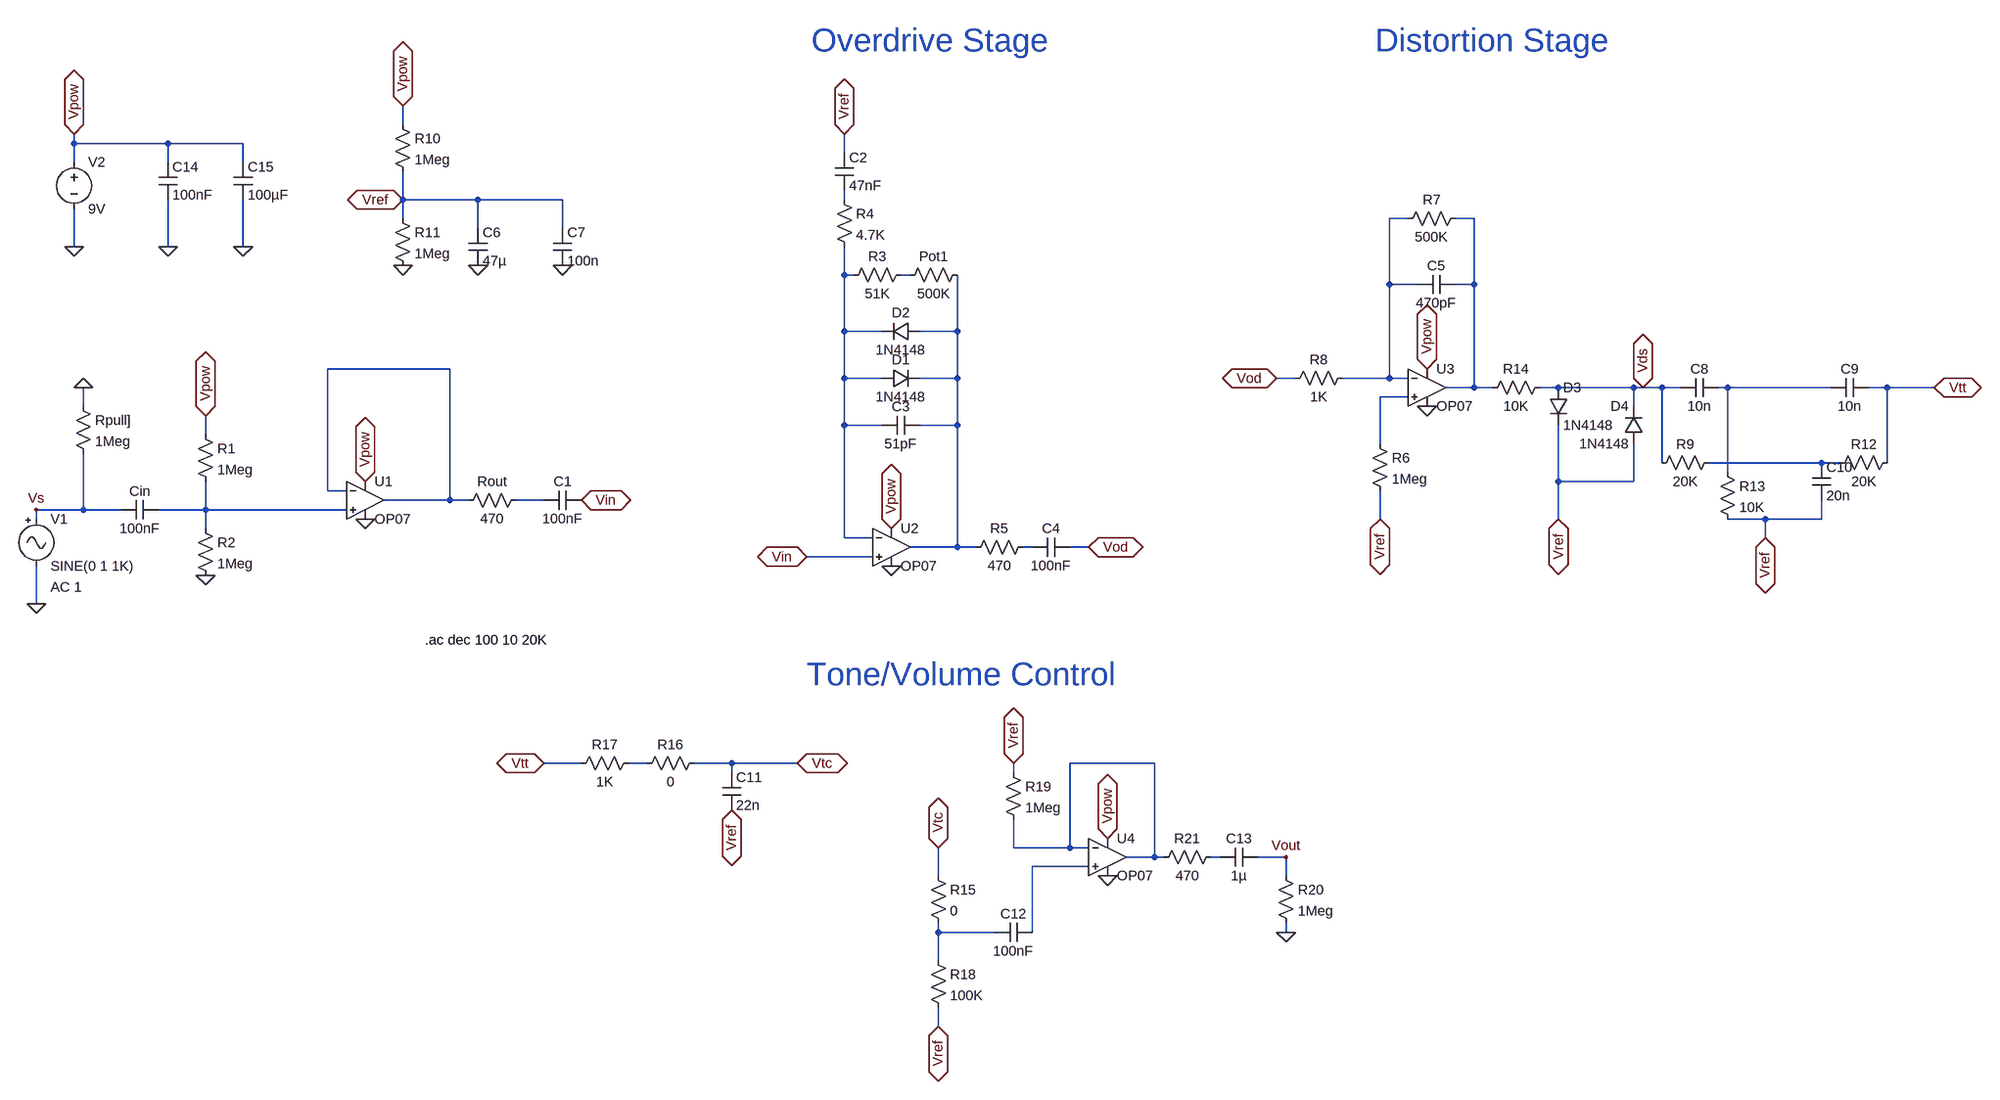
[diagram p0: schematic Overdrive_Distortion_Schematic.asc]
Overdrive_Distortion_Schematic.asc, the LTspice schematic file:
Version 4
SHEET 1 2212 1680
WIRE -912 16 -912 -16
WIRE -1472 48 -1472 32
WIRE -1312 48 -1472 48
WIRE -1184 48 -1312 48
WIRE -160 64 -160 32
WIRE -1472 80 -1472 48
WIRE -1312 80 -1312 48
WIRE -1184 80 -1184 48
WIRE -912 144 -912 96
WIRE -784 144 -912 144
WIRE -640 144 -784 144
WIRE -160 144 -160 128
WIRE -912 176 -912 144
WIRE 800 176 768 176
WIRE 912 176 880 176
WIRE -784 192 -784 144
WIRE -640 192 -640 144
WIRE -1472 224 -1472 160
WIRE -1312 224 -1312 144
WIRE -1184 224 -1184 144
WIRE -160 272 -160 224
WIRE -144 272 -160 272
WIRE -48 272 -64 272
WIRE 768 288 768 176
WIRE 816 288 768 288
WIRE 912 288 912 176
WIRE 912 288 880 288
WIRE -160 368 -160 272
WIRE -96 368 -160 368
WIRE 32 368 32 272
WIRE 32 368 -32 368
WIRE -832 432 -1040 432
WIRE -160 448 -160 368
WIRE -96 448 -160 448
WIRE 32 448 32 368
WIRE 32 448 -32 448
WIRE 608 448 576 448
WIRE 768 448 768 288
WIRE 768 448 688 448
WIRE 800 448 768 448
WIRE 912 464 912 288
WIRE 912 464 864 464
WIRE 944 464 912 464
WIRE 1056 464 1024 464
WIRE 1184 464 1056 464
WIRE 1200 464 1184 464
WIRE 1232 464 1200 464
WIRE 1264 464 1232 464
WIRE 1344 464 1328 464
WIRE 1520 464 1344 464
WIRE 1616 464 1584 464
WIRE 1696 464 1616 464
WIRE 800 480 752 480
WIRE -1456 496 -1456 464
WIRE 1184 496 1184 464
WIRE -160 528 -160 448
WIRE -96 528 -160 528
WIRE 32 528 32 448
WIRE 32 528 -32 528
WIRE -1248 544 -1248 512
WIRE 752 560 752 480
WIRE 1232 592 1232 464
WIRE 1504 592 1312 592
WIRE 1536 592 1504 592
WIRE 1616 592 1616 464
WIRE 1344 608 1344 464
WIRE 1056 624 1056 528
WIRE 1184 624 1184 560
WIRE 1184 624 1056 624
WIRE -1040 640 -1040 432
WIRE -1008 640 -1040 640
WIRE -832 656 -832 432
WIRE -832 656 -944 656
WIRE -800 656 -832 656
WIRE -672 656 -720 656
WIRE -1456 672 -1456 576
WIRE -1456 672 -1536 672
WIRE -1392 672 -1456 672
WIRE -1248 672 -1248 624
WIRE -1248 672 -1328 672
WIRE -1008 672 -1248 672
WIRE -1536 688 -1536 672
WIRE 752 688 752 640
WIRE 1056 688 1056 624
WIRE 1408 688 1344 688
WIRE 1504 688 1504 656
WIRE 1504 688 1408 688
WIRE -1248 704 -1248 672
WIRE -160 720 -160 528
WIRE -112 720 -160 720
WIRE 1408 720 1408 688
WIRE 32 736 32 528
WIRE 32 736 -48 736
WIRE 64 736 32 736
WIRE 160 736 144 736
WIRE 256 736 224 736
WIRE -112 752 -224 752
WIRE -1536 832 -1536 768
WIRE -608 1104 -672 1104
WIRE -496 1104 -528 1104
WIRE -352 1104 -416 1104
WIRE -240 1104 -352 1104
WIRE 368 1104 224 1104
WIRE -352 1120 -352 1104
WIRE 128 1120 128 1104
WIRE 128 1248 128 1200
WIRE 224 1248 224 1104
WIRE 224 1248 128 1248
WIRE 256 1248 224 1248
WIRE 368 1264 368 1104
WIRE 368 1264 320 1264
WIRE 384 1264 368 1264
WIRE 480 1264 464 1264
WIRE 592 1264 544 1264
WIRE 256 1280 160 1280
WIRE 0 1296 0 1248
WIRE 592 1296 592 1264
WIRE 0 1392 0 1376
WIRE 96 1392 0 1392
WIRE 160 1392 160 1280
WIRE 592 1392 592 1376
WIRE 0 1440 0 1392
WIRE 0 1552 0 1520
FLAG -1536 832 0
FLAG -1248 784 0
FLAG -1456 464 0
FLAG -1472 224 0
FLAG -1472 32 Vpow
IOPIN -1472 32 BiDir
FLAG -1248 512 Vpow
IOPIN -1248 512 BiDir
FLAG -976 624 Vpow
IOPIN -976 624 BiDir
FLAG -80 704 Vpow
IOPIN -80 704 BiDir
FLAG 832 432 Vpow
IOPIN 832 432 BiDir
FLAG -976 688 0
FLAG -80 768 0
FLAG 832 496 0
FLAG -912 256 0
FLAG -912 -16 Vpow
IOPIN -912 -16 BiDir
FLAG -160 32 Vref
IOPIN -160 32 BiDir
FLAG 752 688 Vref
IOPIN 752 688 BiDir
FLAG 1056 688 Vref
IOPIN 1056 688 BiDir
FLAG -1536 672 Vs
FLAG -784 256 0
FLAG -640 256 0
FLAG 1408 720 Vref
IOPIN 1408 720 BiDir
FLAG -608 656 Vin
IOPIN -608 656 BiDir
FLAG 256 736 Vod
IOPIN 256 736 BiDir
FLAG 576 448 Vod
IOPIN 576 448 BiDir
FLAG -912 144 Vref
IOPIN -912 144 BiDir
FLAG 1696 464 Vtt
IOPIN 1696 464 BiDir
FLAG -224 752 Vin
IOPIN -224 752 BiDir
FLAG 1200 464 Vds
IOPIN 1200 464 BiDir
FLAG -352 1184 Vref
IOPIN -352 1184 BiDir
FLAG -672 1104 Vtt
IOPIN -672 1104 BiDir
FLAG -240 1104 Vtc
IOPIN -240 1104 BiDir
FLAG 0 1552 Vref
IOPIN 0 1552 BiDir
FLAG 0 1248 Vtc
IOPIN 0 1248 BiDir
FLAG 128 1104 Vref
IOPIN 128 1104 BiDir
FLAG 592 1264 Vout
FLAG 288 1232 Vpow
IOPIN 288 1232 BiDir
FLAG 288 1296 0
FLAG 592 1392 0
FLAG -1312 224 0
FLAG -1184 224 0
SYMBOL OpAmps\\OP07 -976 592 R0
SYMATTR InstName U1
SYMBOL Misc\\signal -1536 672 R0
WINDOW 123 24 132 Left 2
WINDOW 39 0 0 Left 0
SYMATTR Value2 AC 1
SYMATTR InstName V1
SYMBOL cap -1328 656 R90
WINDOW 0 0 32 VBottom 2
WINDOW 3 32 32 VTop 2
SYMATTR InstName Cin
SYMATTR Value 100nF
SYMBOL res -1264 528 R0
SYMATTR InstName R1
SYMATTR Value 1Meg
SYMBOL res -1264 688 R0
SYMATTR InstName R2
SYMATTR Value 1Meg
SYMBOL res -704 640 R90
WINDOW 0 0 56 VBottom 2
WINDOW 3 32 56 VTop 2
SYMATTR InstName Rout
SYMATTR Value 470
SYMBOL cap -608 640 R90
WINDOW 0 0 32 VBottom 2
WINDOW 3 32 32 VTop 2
SYMATTR InstName C1
SYMATTR Value 100nF
SYMBOL OpAmps\\OP07 -80 672 R0
SYMATTR InstName U2
SYMBOL res 48 256 R90
WINDOW 0 0 56 VBottom 2
WINDOW 3 32 56 VTop 2
SYMATTR InstName Pot1
SYMATTR Value 500K
SYMBOL res -176 128 R0
SYMATTR InstName R4
SYMATTR Value 4.7K
SYMBOL diode -96 464 R270
WINDOW 0 32 32 VTop 2
WINDOW 3 0 32 VBottom 2
SYMATTR InstName D1
SYMATTR Value 1N4148
SYMBOL diode -32 352 R90
WINDOW 0 0 32 VBottom 2
WINDOW 3 32 32 VTop 2
SYMATTR InstName D2
SYMATTR Value 1N4148
SYMBOL cap -176 64 R0
SYMATTR InstName C2
SYMATTR Value 47nF
SYMBOL cap -32 512 R90
WINDOW 0 0 32 VBottom 2
WINDOW 3 32 32 VTop 2
SYMATTR InstName C3
SYMATTR Value 51pF
SYMBOL res -48 256 R90
WINDOW 0 0 56 VBottom 2
WINDOW 3 32 56 VTop 2
SYMATTR InstName R3
SYMATTR Value 51K
SYMBOL OpAmps\\OP07 832 400 R0
SYMATTR InstName U3
SYMBOL cap 224 720 R90
WINDOW 0 0 32 VBottom 2
WINDOW 3 32 32 VTop 2
SYMATTR InstName C4
SYMATTR Value 100nF
SYMBOL cap 880 272 R90
WINDOW 0 0 32 VBottom 2
WINDOW 3 32 32 VTop 2
SYMATTR InstName C5
SYMATTR Value 470pF
SYMBOL res 896 160 R90
WINDOW 0 0 56 VBottom 2
WINDOW 3 32 56 VTop 2
SYMATTR InstName R7
SYMATTR Value 500K
SYMBOL diode 1040 464 R0
SYMATTR InstName D3
SYMATTR Value 1N4148
SYMBOL diode 1200 560 R180
WINDOW 0 24 64 Left 2
WINDOW 3 24 0 Left 2
SYMATTR InstName D4
SYMATTR Value 1N4148
SYMBOL res 160 720 R90
WINDOW 0 0 56 VBottom 2
WINDOW 3 32 56 VTop 2
SYMATTR InstName R5
SYMATTR Value 470
SYMBOL res 736 544 R0
SYMATTR InstName R6
SYMATTR Value 1Meg
SYMBOL res -1472 480 R0
SYMATTR InstName Rpull]
SYMATTR Value 1Meg
SYMBOL res 704 432 R90
WINDOW 0 0 56 VBottom 2
WINDOW 3 32 56 VTop 2
SYMATTR InstName R8
SYMATTR Value 1K
SYMBOL voltage -1472 64 R0
WINDOW 123 0 0 Left 0
WINDOW 39 0 0 Left 0
SYMATTR InstName V2
SYMATTR Value 9V
SYMBOL res -928 0 R0
SYMATTR InstName R10
SYMATTR Value 1Meg
SYMBOL res -928 160 R0
SYMATTR InstName R11
SYMATTR Value 1Meg
SYMBOL cap -800 192 R0
SYMATTR InstName C6
SYMATTR Value 47µ
SYMBOL cap -656 192 R0
SYMATTR InstName C7
SYMATTR Value 100n
SYMBOL res 1632 576 R90
WINDOW 0 0 56 VBottom 2
WINDOW 3 32 56 VTop 2
SYMATTR InstName R12
SYMATTR Value 20K
SYMBOL cap 1328 448 R90
WINDOW 0 0 32 VBottom 2
WINDOW 3 32 32 VTop 2
SYMATTR InstName C8
SYMATTR Value 10n
SYMBOL cap 1584 448 R90
WINDOW 0 0 32 VBottom 2
WINDOW 3 32 32 VTop 2
SYMATTR InstName C9
SYMATTR Value 10n
SYMBOL res 1328 592 R0
SYMATTR InstName R13
SYMATTR Value 10K
SYMBOL cap 1488 592 R0
SYMATTR InstName C10
SYMATTR Value 20n
SYMBOL res 1040 448 R90
WINDOW 0 0 56 VBottom 2
WINDOW 3 32 56 VTop 2
SYMATTR InstName R14
SYMATTR Value 10K
SYMBOL res 1328 576 R90
WINDOW 0 0 56 VBottom 2
WINDOW 3 32 56 VTop 2
SYMATTR InstName R9
SYMATTR Value 20K
SYMBOL res -400 1088 R90
WINDOW 0 0 56 VBottom 2
WINDOW 3 32 56 VTop 2
SYMATTR InstName R16
SYMATTR Value 0
SYMBOL cap -368 1120 R0
SYMATTR InstName C11
SYMATTR Value 22n
SYMBOL res -16 1280 R0
SYMATTR InstName R15
SYMATTR Value 0
SYMBOL res -512 1088 R90
WINDOW 0 0 56 VBottom 2
WINDOW 3 32 56 VTop 2
SYMATTR InstName R17
SYMATTR Value 1K
SYMBOL OpAmps\\OP07 288 1200 R0
SYMATTR InstName U4
SYMBOL res -16 1424 R0
SYMATTR InstName R18
SYMATTR Value 100K
SYMBOL cap 160 1376 R90
WINDOW 0 0 32 VBottom 2
WINDOW 3 32 32 VTop 2
SYMATTR InstName C12
SYMATTR Value 100nF
SYMBOL res 112 1104 R0
SYMATTR InstName R19
SYMATTR Value 1Meg
SYMBOL cap 544 1248 R90
WINDOW 0 0 32 VBottom 2
WINDOW 3 32 32 VTop 2
SYMATTR InstName C13
SYMATTR Value 1µ
SYMBOL res 576 1280 R0
SYMATTR InstName R20
SYMATTR Value 1Meg
SYMBOL res 480 1248 R90
WINDOW 0 0 56 VBottom 2
WINDOW 3 32 56 VTop 2
SYMATTR InstName R21
SYMATTR Value 470
SYMBOL cap -1328 80 R0
SYMATTR InstName C14
SYMATTR Value 100nF
SYMBOL cap -1200 80 R0
SYMATTR InstName C15
SYMATTR Value 100µF
TEXT -216 -128 Left 5 ;Overdrive Stage
TEXT 744 -128 Left 5 ;Distortion Stage
TEXT -224 952 Left 5 ;Tone/Volume Control
TEXT -874 894 Left 2 !.ac dec 100 10 20K

The netlist it stands for:
* Overdrive_Distortion_Schematic.asc
XU1 N012 N007 Vpow 0 N007 LT1001  ; OP07, pins In+ In- V+ V- OUT
V1 Vs 0 SINE(0 1 1K) AC 1
Cin N012 Vs 100nF
R1 Vpow N012 1Meg
R2 N012 0 1Meg
Rout N011 N007 470
C1 Vin N011 100nF
XU2 Vin N004 Vpow 0 N006 LT1001  ; OP07, pins In+ In- V+ V- OUT
R§Pot1 N006 N005 500K
R4 N001 N004 4.7K
D1 N004 N006 1N4148
D2 N006 N004 1N4148
C2 Vref N001 47nF
C3 N006 N004 51pF
R3 N005 N004 51K
XU3 N009 N002 Vpow 0 N003 LT1001  ; OP07, pins In+ In- V+ V- OUT
C4 Vod N013 100nF
C5 N003 N002 470pF
R7 N003 N002 500K
D3 Vds Vref 1N4148
D4 Vref Vds 1N4148
R5 N013 N006 470
R6 N009 Vref 1Meg
Rpull] 0 Vs 1Meg
R8 N002 Vod 1K
V2 Vpow 0 9V
R10 Vpow Vref 1Meg
R11 Vref 0 1Meg
C6 Vref 0 47µ
C7 Vref 0 100n
R12 Vtt N010 20K
C8 N008 Vds 10n
C9 Vtt N008 10n
R13 N008 Vref 10K
C10 N010 Vref 20n
R14 Vds N003 10K
R9 N010 Vds 20K
R16 Vtc N014 0
C11 Vtc Vref 22n
R15 Vtc N018 0
R17 N014 Vtt 1K
XU4 N017 N015 Vpow 0 N015 LT1001  ; OP07, pins In+ In- V+ V- OUT
R18 N018 Vref 100K
C12 N017 N018 100nF
R19 Vref N015 1Meg
C13 Vout N016 1µ
R20 Vout 0 1Meg
R21 N016 N015 470
C14 Vpow 0 100nF
C15 Vpow 0 100µF
.model D D
.lib standard.dio
* Overdrive Stage
* Distortion Stage
* Tone/Volume Control
.ac dec 100 10 20K
.lib LTC.lib
.backanno
.end